# Altium schematic sheet Cap 4.7uF 805.schdoc
size 127 x 101 mm
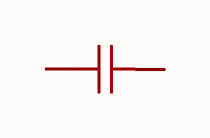
[diagram p0: Cap 4.7uF 805.schdoc]

## Parts
C?  4.7uF  [C0805]  (value not drawn)

## Nets

Not connected (* = marked no-connect by the designer): C? 1 2

## Library data of the parts
C? = GRM219R61A475KE34D: Manufacturer: muRata(村田); Add into BOM: yes; Tolerance: ±10%; Symbol: GRM219R61A475KE34D; Device: GRM219R61A475KE34D; LCSC Part Name: 4.7uF ±10% 10V; Supplier Part: C237307; Manufacturer Part: GRM219R61A475KE34D; Supplier Footprint: 0805; JLCPCB Part Class: Extended Part; Datasheet: https://atta.szlcsc.com/upload/public/pdf/source/20191220/C237307_8DE5545EAC16C515184C701B10B39486.pdf; Supplier: LCSC; Convert to PCB: yes; Value: 4.7uF